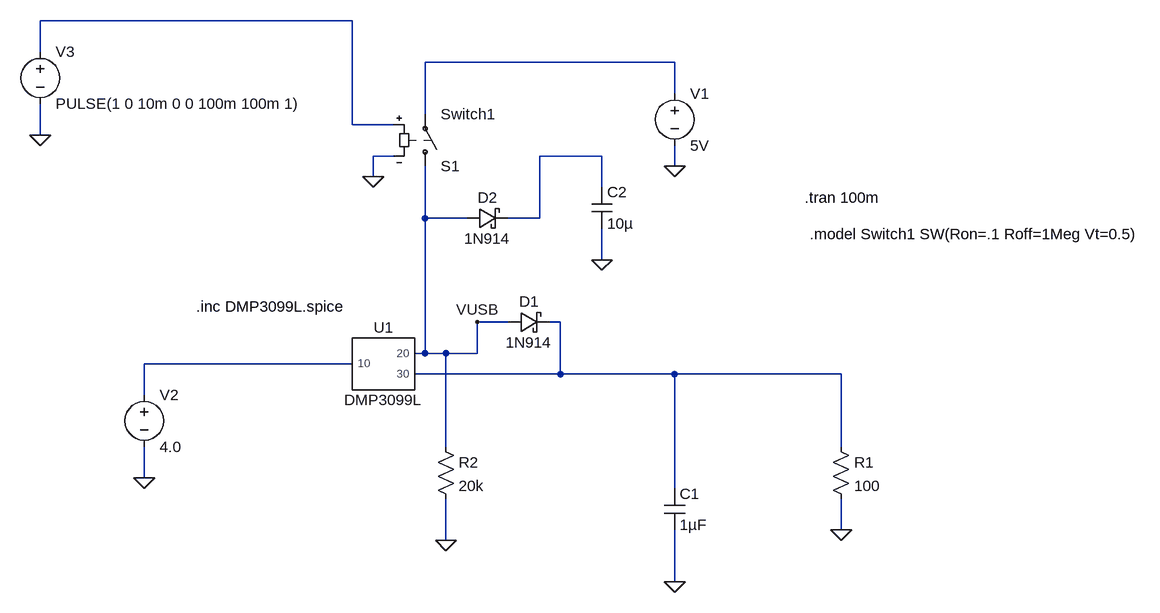
[diagram p0: schematic battery-usb-power-crossover.asc]
battery-usb-power-crossover.asc, the LTspice schematic file:
Version 4
SHEET 1 1428 680
WIRE 80 -416 -400 -416
WIRE -400 -368 -400 -416
WIRE 576 -352 192 -352
WIRE 576 -304 576 -352
WIRE 192 -272 192 -352
WIRE 80 -256 80 -416
WIRE 144 -256 80 -256
WIRE -400 -240 -400 -288
WIRE 144 -208 112 -208
WIRE 464 -208 368 -208
WIRE 576 -192 576 -224
WIRE 112 -176 112 -208
WIRE 464 -160 464 -208
WIRE 192 -112 192 -192
WIRE 256 -112 192 -112
WIRE 368 -112 368 -208
WIRE 368 -112 320 -112
WIRE 464 -48 464 -96
WIRE 320 48 272 48
WIRE 400 48 384 48
WIRE 192 96 192 -112
WIRE 192 96 176 96
WIRE 224 96 192 96
WIRE 272 96 272 48
WIRE 272 96 224 96
WIRE 80 112 -240 112
WIRE 400 128 400 48
WIRE 400 128 176 128
WIRE 576 128 400 128
WIRE 832 128 576 128
WIRE -240 160 -240 112
WIRE 224 240 224 96
WIRE 832 240 832 128
WIRE -240 288 -240 240
WIRE 576 304 576 128
WIRE 832 368 832 320
WIRE 224 384 224 320
WIRE 576 448 576 368
FLAG 576 448 0
FLAG 832 368 0
FLAG 272 48 VUSB
FLAG 576 -192 0
FLAG -240 288 0
FLAG 112 -176 0
FLAG -400 -240 0
FLAG 224 384 0
FLAG 464 -48 0
SYMBOL schottky 320 64 R270
WINDOW 0 32 32 VTop 2
WINDOW 3 0 32 VBottom 2
SYMATTR InstName D1
SYMATTR Value 1N914
SYMBOL cap 560 304 R0
SYMATTR InstName C1
SYMATTR Value 1µF
SYMBOL res 816 224 R0
SYMATTR InstName R1
SYMATTR Value 100
SYMBOL voltage 576 -320 R0
WINDOW 123 0 0 Left 0
WINDOW 39 0 0 Left 0
SYMATTR InstName V1
SYMATTR Value 5V
SYMBOL voltage -240 144 R0
WINDOW 123 0 0 Left 0
WINDOW 39 0 0 Left 0
SYMATTR InstName V2
SYMATTR Value 4.0
SYMBOL sw 192 -176 M180
SYMATTR InstName S1
SYMATTR Value Switch1
SYMBOL voltage -400 -384 R0
WINDOW 123 0 0 Left 0
WINDOW 39 0 0 Left 0
SYMATTR InstName V3
SYMATTR Value PULSE(1 0 10m 0 0 100m 100m 1)
SYMBOL res 208 224 R0
SYMATTR InstName R2
SYMATTR Value 20k
SYMBOL cap 448 -160 R0
SYMATTR InstName C2
SYMATTR Value 10µ
SYMBOL schottky 256 -96 R270
WINDOW 0 32 32 VTop 2
WINDOW 3 0 32 VBottom 2
SYMATTR InstName D2
SYMATTR Value 1N914
SYMBOL DMP3099L 128 112 R0
SYMATTR InstName U1
TEXT 776 -144 Left 2 !.tran 100m
TEXT 784 -88 Left 2 !.model Switch1 SW(Ron=.1 Roff=1Meg Vt=0.5)
TEXT -160 24 Left 2 !.inc DMP3099L.spice

The netlist it stands for:
* battery-usb-power-crossover.asc
D1 VUSB N004 1N914
C1 N004 0 1µF
R1 N004 0 100
V1 N002 0 5V
V2 N005 0 4.0
S1 VUSB N002 N001 0 Switch1
V3 N001 0 PULSE(1 0 10m 0 0 100m 100m 1)
R2 VUSB 0 20k
C2 N003 0 10µ
D2 VUSB N003 1N914
XU1 N005 VUSB N004 DMP3099L  ; pins 10 20 30
.model D D
.lib standard.dio
.tran 100m
.model Switch1 SW(Ron=.1 Roff=1Meg Vt=0.5)
.inc DMP3099L.spice
.backanno
.end